# Altium schematic sheet Protocol.SchDoc
size A4; SheetNumber: 5; SheetTotal: 5
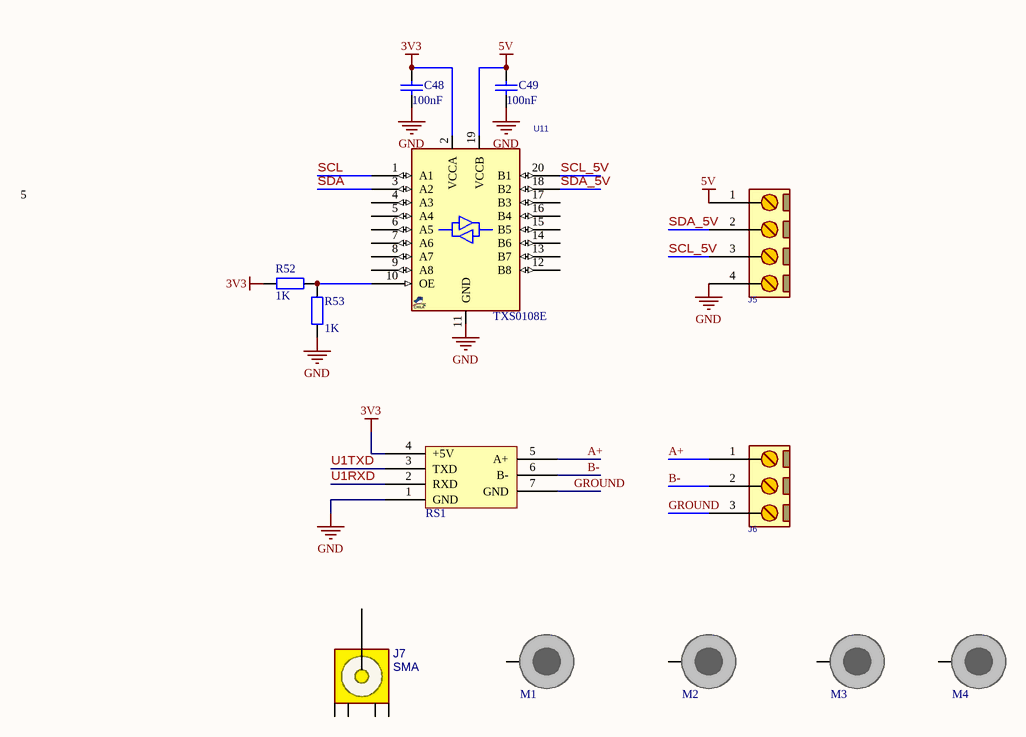
[diagram p0: Protocol.SchDoc]

## Parts
C48  Ma_Hang: 100nF  [tu 0603]  (hidden comment: 100nF_0603_1%)
C49  Ma_Hang: 100nF  [tu 0603]  (hidden comment: 100nF_0603_1%)
J5  CONN_TB4  [TBB_4]  (value not drawn)
J6  CONN_TB3  [TBB_3]  (value not drawn)
J7  SMA  [SMA_RA]
M1  DNP/MH  [SCMH_M3FT]  (value not drawn)  (no BOM)
M2  DNP/MH  [SCMH_M3FT]  (value not drawn)  (no BOM)
M3  DNP/MH  [SCMH_M3FT]  (value not drawn)  (no BOM)
M4  DNP/MH  [SCMH_M3FT]  (value not drawn)  (no BOM)
R52  Ma_Hang: 1K  [tro smd 0603]  (hidden comment: 1K_0603_1%)
R53  Ma_Hang: 1K  [tro smd 0603]  (hidden comment: 1K_0603_1%)
RS1  RS485_VISION2  [RS485 - Version2]  (value not drawn)
U11  TXS0108E  [SOG65_20]

## Nets
3V3: C48.1 R52.2 RS1.4(+5V) U11.2(VCCA)
5V: C49.1 J5.1 U11.19(VCCB)
GND: C48.2 C49.2 J5.4 R53.1 RS1.1(GND) U11.11(GND)
A+: J6.1 RS1.5(A+)
B-: J6.2 RS1.6(B-)
GROUND: J6.3 RS1.7(GND)
SCL: U11.1(A1)
SCL_5V: J5.3 U11.20(B1)
SDA: U11.3(A2)
SDA_5V: J5.2 U11.18(B2)
U1RXD: RS1.2(RXD)
U1TXD: RS1.3(TXD)
NetR52_1: R52.1 R53.2 U11.10(OE)

Not connected (* = marked no-connect by the designer): J7 1(SIG) 2(G1) 3(G2) 4(G3) 5(G4); M1 1; M2 1; M3 1; M4 1; U11 4(A3) 5(A4) 6(A5) 7(A6) 8(A7) 9(A8) 12(B8) 13(B7) 14(B6) 15(B5) 16(B4) 17(B3)

## Notes on the sheet
- 5

## Library data of the parts
C48 C49 = Tu 0603 470pF 50V 10%: Capacitor, Ceramic, 50V; Chung_Loai: Dán; Don_Vi: Con; So_Chan: 2; Ten_Linh_Kien: Tụ 0603 470P 50V 10%; Kieu_Chan: *
J5 = CONN_TB4: CONN, TERMINAL BLOCK, 5.08mm pitch; VALUE: CONN_TB4
J6 = CONN_TB3: CONN, TERMINAL BLOCK, 5.08mm pitch; VALUE: CONN_TB3
J7 = CONN_RF_SMA_RA: CONN, RF, SMA, Right Angle; MANF_P#: SMA-J-P-H-RA-TH1; MANF: Samtec; PARAM: 50Ohm, 20GHz; DESC: DESCRIPTION; DIST#: DIGIKEY; PARAM2: GOLD; ASSEMBLY: ASSEMBLY; PRICE: 6.3$; VALUE: SMA
M1-M4 = SCMH_M3FT: SCREW mouting, M3, 3.0mm diameter and 6.0mm, FlatHead; ASSEMBLY: DNP; VALUE: DNP/MH
R52 R53 = Tro 0603 5% 10k: RES SMD 0603; Chung_Loai: Dán; Don_Vi: Con; So_Chan: 2; Ten_Linh_Kien: Trở 0603 5% 10k; Kieu_Chan: *
U11 = TXS0108_SSOP20: Level Translator, Octal; MANF: Texas Instruments; MANF_P#: TXS0108EPWR; VALUE: TXS0108E